# Altium schematic sheet power_regulator_aux.SchDoc
size A4; SheetNumber: 5; SheetTotal: 21
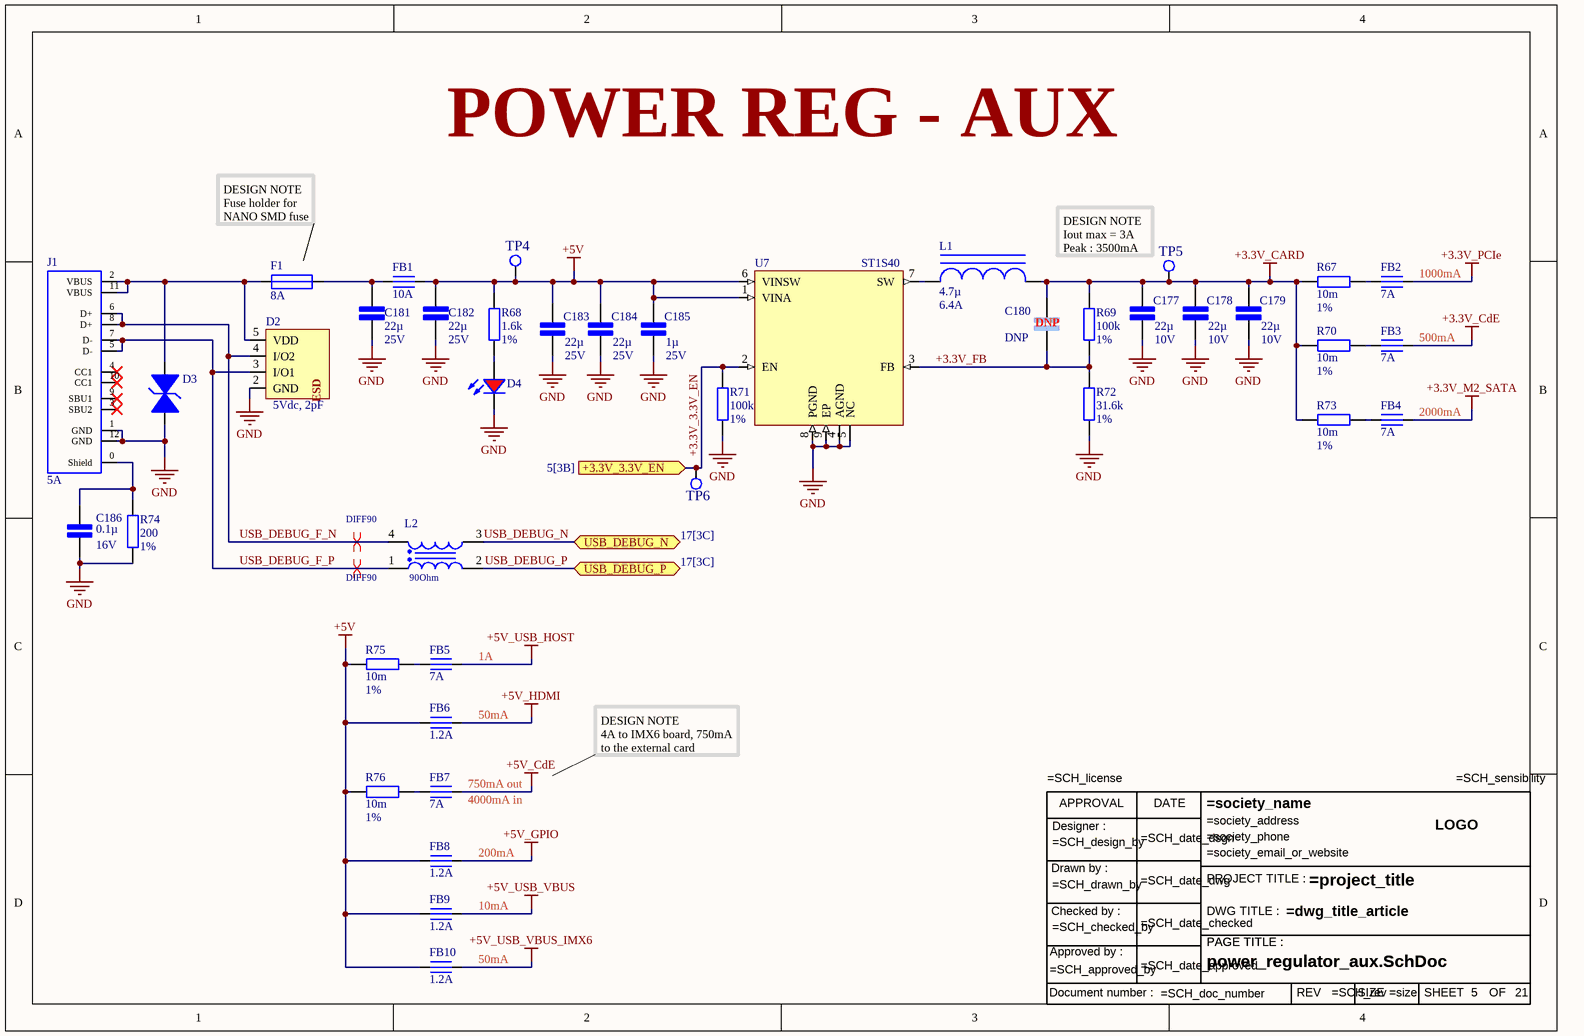
[diagram p0: power_regulator_aux.SchDoc]

## Parts
C177  22µ  Tension du diélectrique: 10V  [Cap cer 0603/4608]
C178  22µ  Tension du diélectrique: 10V  [Cap cer 0603/4608]
C179  22µ  Tension du diélectrique: 10V  [Cap cer 0603/4608]
C180  DNP  [Cap cer 0402/1005]
C181  22µ  Tension du diélectrique: 25V  [Cap cer 0805/2012]
C182  22µ  Tension du diélectrique: 25V  [Cap cer 0805/2012]
C183  22µ  Tension du diélectrique: 25V  [Cap cer 0805/2012]
C184  22µ  Tension du diélectrique: 25V  [Cap cer 0805/2012]
C185  1µ  Tension du diélectrique: 25V  [Cap cer 0402/1005]
C186  0.1µ  Tension du diélectrique: 16V  [Cap cer 0402/1005]
D2  5Vdc, 2pF  [Sot-23-5]
D3  TVS 5V  [inductor 0402/1005]  (value not drawn)
D4  Red, 2V, 120deg  [LED red 0603]  (value not drawn)
F1  8A  [Fuse holder SMD 01550900M]
FB1  10A  [Ferrite SMD 1612]
FB2  7A  [inductor 0603/1603]
FB3  7A  [inductor 0603/1603]
FB4  7A  [inductor 0603/1603]
FB5  7A  [inductor 0603/1603]
FB6  1.2A  [inductor 0402/1005]
FB7  7A  [inductor 0603/1603]
FB8  1.2A  [inductor 0402/1005]
FB9  1.2A  [inductor 0402/1005]
FB10  1.2A  [inductor 0402/1005]
J1  5A  [USB C 12 Pin EXT 629722000214]
L1  4.7µ  Saturation: 6.4A  [inductor 4030 74438357047]
L2  90Ohm  [inductor coupled usb 0603]
R67  10m  pourcentage: 1%  [Res 0603/1603]
R68  1.6k  pourcentage: 1%  [Res 0402/1005]
R69  100k  pourcentage: 1%  [Res 0402/1005]
R70  10m  pourcentage: 1%  [Res 0603/1603]
R71  100k  pourcentage: 1%  [Res 0402/1005]
R72  31.6k  pourcentage: 1%  [Res 0402/1005]
R73  10m  pourcentage: 1%  [Res 0603/1603]
R74  200  pourcentage: 1%  [Res 0402/1005]
R75  10m  pourcentage: 1%  [Res 0603/1603]
R76  10m  pourcentage: 1%  [Res 0603/1603]
TB6  Title bloc ANSI modified  (value not drawn)
TP4  Test Point  [testpoint 1mm]  (value not drawn)
TP5  Test Point  [testpoint 1mm]  (value not drawn)
TP6  Test Point  [testpoint 1mm]  (value not drawn)
U7  ST1S40  [SON 4x4 ST1S40]

## Ports
+3.3V_3.3V_EN (in, see 5[3B]), USB_DEBUG_N (bidir, see 17[3C]), USB_DEBUG_P (bidir, see 17[3C])

## Nets
+3.3V_CARD: C177.1 C178.1 C179.1 C180.1 L1.2 R67.1 R69.2 R70.1 R73.1 TP5.1(tp)
+3.3V_CdE: FB3.2
+3.3V_M2_SATA: FB4.2
+3.3V_PCIe: FB2.2
+5V: C182.1 C183.1 C184.1 C185.1 FB1.2 FB6.1 FB8.1 FB9.1 FB10.1 R68.2 R75.1 R76.1 TP4.1(tp) U7.1(VINA) U7.6(VINSW)
+5V_CdE: FB7.2
+5V_GPIO: FB8.2
+5V_HDMI: FB6.2
+5V_USB_HOST: FB5.2
+5V_USB_VBUS: FB9.2
+5V_USB_VBUS_IMX6: FB10.2
GND: C177.2 C178.2 C179.2 C181.2 C182.2 C183.2 C184.2 C185.2 C186.2 D2.2(GND) D3.2 D4.1(K) J1.1(GND) J1.12(GND) R71.1 R72.1 R74.1 U7.4(AGND) U7.5(NC) U7.8(PGND) U7.9(EP)
+3.3V_3.3V_EN: R71.2 TP6.1(tp) U7.2(EN) ; port +3.3V_3.3V_EN
+3.3V_FB: C180.2 R69.1 R72.2 U7.3(FB)
USB_DEBUG_F_N: D2.4(I/O2) J1.6(D+) J1.8(D+) L2.4
USB_DEBUG_F_P: D2.3(I/O1) J1.5(D-) J1.7(D-) L2.1
USB_DEBUG_N: L2.3 ; port USB_DEBUG_N
USB_DEBUG_P: L2.2 ; port USB_DEBUG_P
NetC181_1: C181.1 F1.2 FB1.1
NetC186_1: C186.1 J1.0(Shield) R74.2
NetD2_5: D2.5(VDD) D3.1 F1.1 J1.2(VBUS) J1.11(VBUS)
NetD4_2: D4.2(A) R68.1
NetFB2_1: FB2.1 R67.2
NetFB3_1: FB3.1 R70.2
NetFB4_1: FB4.1 R73.2
NetFB5_1: FB5.1 R75.2
NetFB7_1: FB7.1 R76.2
NetL1_1: L1.1 U7.7(SW)

Not connected (* = marked no-connect by the designer): J1 3(SBU2)* 4(CC1)* 9(SBU1)* 10(CC1)*

## Layout directives
differential pair; differential pair class DIFF90: USB_DEBUG_F_N, USB_DEBUG_F_P

## Notes on the sheet
- POWER REG - AUX
- DESIGN NOTE
  Fuse holder for NANO SMD fuse
- (near TP5) DESIGN NOTE
  Iout max = 3A
  Peak : 3500mA
- (near FB2) 1000mA
- (near FB3) 500mA
- (near FB4) 2000mA
- (near FB6) 50mA
- (near FB5) 1A
- (near FB7) 750mA out
- DESIGN NOTE
  4A to IMX6 board, 750mA to the external card
- (near FB7) 4000mA in
- (near FB8) 200mA
- (near FB9) 10mA
- (near FB10) 50mA
- (in symbol Title bloc ANSI) APPROVAL; DATE; Designer :; LOGO; Drawn by :; PROJECT TITLE :; Checked by :; DWG TITLE :; PAGE TITLE :; Approved by :; Document number :; REV; SIZE; SHEET; OF
- (in symbol TVS USB 824011) ESD

## Library data of the parts
C177-C179 = cap 22µ 10V: cap cer 22µ 10V 10% X5R 0603; Diélectrique: X5R
C180 = cap DNP: cap cer DNP 0402
C181-C184 = cap 22µ 25V: cap cer 22µ 25V 10% X5R 0805; Diélectrique: X5R
C185 = cap 1µ 25V: cap cer 1µ 25V 10% X5R 0402; Diélectrique: X5R
C186 = cap 0.1µ 16V: cap solid electrolyte 0.1µ 6.3V 10%; Diélectrique: X7R
D2 = TVS USB 824011: WE-TVS TVS Diode – High Speed Series, SOT23-5L, 2+1 Channel, 5Vdc, 2pF; Manufacturer Part Number: 824011; Manufacturer: Wurth Elektronik; Reverse Peak Pulse Current: 13A; Channel ESD Clamping Voltage: 13V; Channel Operating Voltage: 5V; Channel Reverse Leakage Current: 1uA; ESD Air Discharge Capability: 24kV; ESD Contact Discharge Capability: 16kV; Polarity: Unidirectional; Reverse Breakdown Voltage: 6.1V; ComponentLink1Description: Manufacturer Link; ComponentLink1URL: http://www.we-online.de; ComponentLink2Description: Datasheet; ComponentLink2URL: https://www.we-online.com/catalog/datasheet/824011.pdf; Size: SOT23-5L; Mounting Technology: SMT; Packaging: Tape and Reel; Channel Input Capacitance: 2pF; Channel Number: 2+1; Height: 1.16mm; Length: 2.9mm; Operating Temperature max.: 125C; Operating Temperature min.: -55C; Width: 2.8mm
D3 = TVS suppressor 82357120050: 82357120050; ComponentLink1Description: New link; ComponentLink1URL: https://www.we-online.com/catalog/datasheet/82357120050.pdf
D4 = LED Red 0603: WL-SMCC SMD Mono-color Chip LED Compact, size 0603, Red, 2V, 120deg 150060RS73220; Dominant Wavelength: 624nm; Luminous Intensity: 90mcd; Peak Wavelength: 632nm; Chip Technology: AlInGaP; ComponentLink1URL: http://www.we-online.de; ComponentLink2Description: Datasheet; ComponentLink2URL: https://katalog.we-online.com/led/datasheet/150060RS73220.pdf; Part Number: 150060RS73220; Published Date: July 2019; Publisher: Wurth Elektronik; Size: 0603; Viewing Angle: 120deg; Packaging: Tape and Reel; Emitting Color: Red; Mounting Technology: SMT; Forward Voltage: 2V; Operating Temperature: -40 to +85degC
F1 = Fuse_8A_SMD: Fuse 6A SMD 2410 / NANO; ComponentLink1Description: New link; ComponentLink1URL: https://www.mouser.fr/datasheet/2/240/Littelfuse_Fuse_154_154T_154L_154TL_Datasheet_pdf-365375.pdf
FB1 = Ferrite bead 1612: ferrite bead 10A 2.5m Ohm / 74279223560; ComponentLink1Description: New link; ComponentLink1URL: https://www.we-online.com/catalog/datasheet/74279223560.pdf
FB2-FB5 FB7 = Ferrite bead 0603: ferrite bead 17AA 2mohm / 7426926222; ComponentLink1Description: New link; ComponentLink1URL: https://www.we-online.com/catalog/datasheet/7426926222.pdf
FB6 FB8-FB10 = Ferrite bead 0402: ferrite bead 1.2A 70mohm / 74269242111; ComponentLink1Description: New link; ComponentLink1URL: https://www.we-online.com/catalog/datasheet/74269242111.pdf
J1 = USB C 12 pin EXT 629722000214: 629722000214 wurth connector, up to 5A, with bottom pads for more cables
L1 = inductor 4.7µ 6.4A: inductor 4.7µ 6.4A sat 4030 / 74438357047; ComponentLink1Description: New link; ComponentLink1URL: https://www.we-online.com/catalog/datasheet/74438357047.pdf
L2 = inductor coupled USB: WE-CNSW SMT Common Mode Line Filter, size 0603, 90Ohm, 0.55A, 50V; Manufacturer Part Number: 744230900; Manufacturer: Wurth Elektronik; DC Resistance max.: 0.145Ohm; Impedance Test Condition: 100MHz; Insulation Test Voltage: 125VAC; Winding Style: bifiliar; ComponentLink1Description: Manufacturer; ComponentLink1URL: http://www.we-online.de; ComponentLink2Description: Datasheet; ComponentLink2URL: https://www.we-online.com/catalog/datasheet/744230900.pdf; Operating Temperature: -40 to +125degC; Packaging: Tape and Reel; Published Date: April 2020; Rated Current: 0.55A; Size: 0603; Impedance: 90Ohm; Rated Voltage: 50V; Mounting Technology: SMT
R67 R70 R73 R75 R76 = res 10m 1%: res 10m 1% 0.33W 0603
R68 = res 1.6k 1%: res 1.6k 1% 0402
R69 R71 = res 100k 1%: res 100k 1% 0402
R72 = res 31.6k 1%: res 31.6k 1% 0402
R74 = res 200 1%: res 200 1% 0402
TB6 = Title bloc ANSI
TP4-TP6 = Test Point: Test point 1mm diameter
U7 = IC ST1S40 QFN: switching regulator